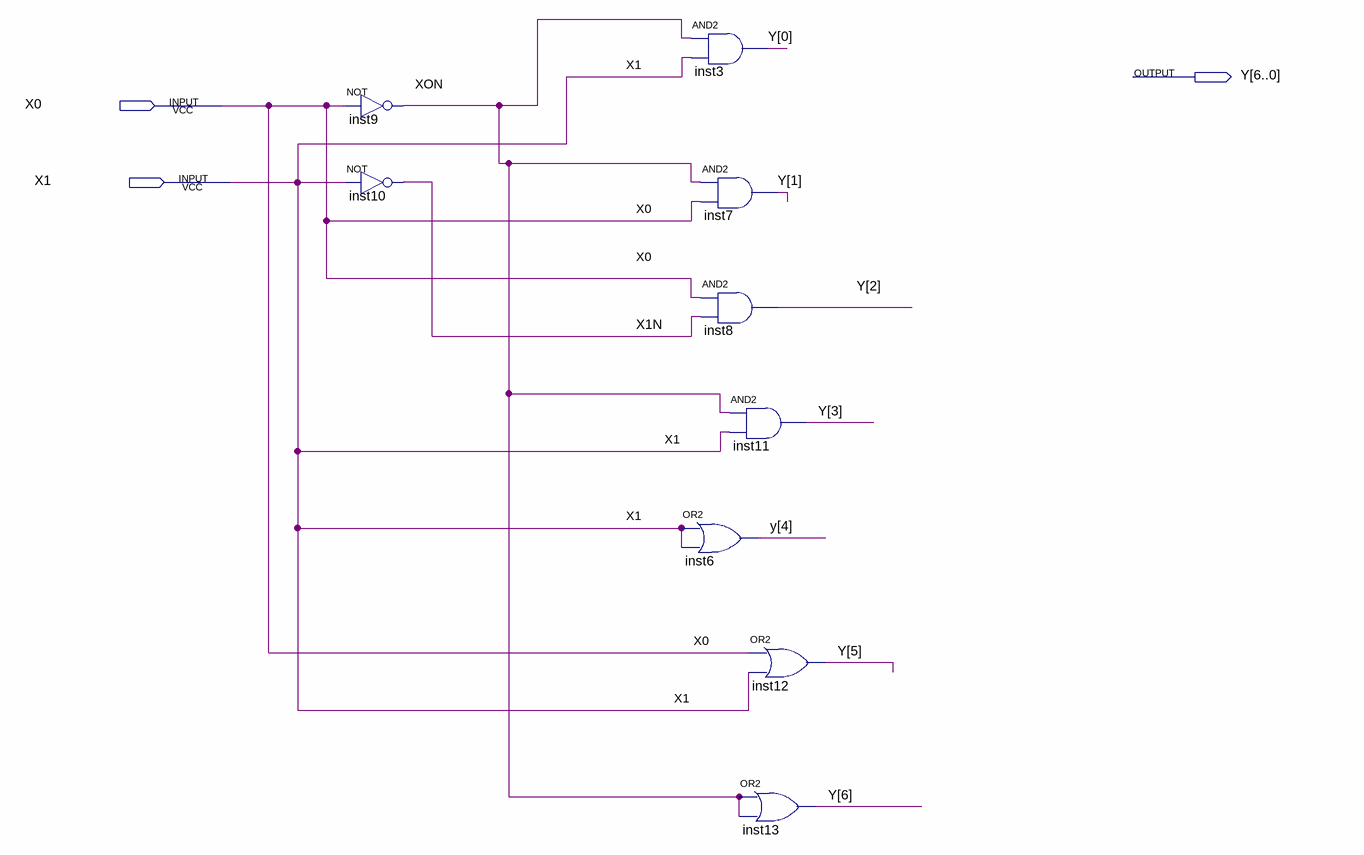
[diagram p0: schematic sheet]
// Quartus schematic TETRA_to_7_seg.bdf as structural Verilog: 9 symbols, 3 pins
module TETRA_to_7_seg (
  input  X0,
  input  X1,
  output [6:0] Y
);

  wire X1N, XON;

  not inst9 (XON, X0);
  not inst10 (X1N, X1);
  and inst3 (Y[0], XON, X1);
  and inst7 (Y[1], XON, X0);
  and inst8 (Y[2], X0, X1N);
  or inst6 (Y[4], X1, X1);
  and inst11 (Y[3], XON, X1);
  or inst12 (Y[5], X0, X1);
  or inst13 (Y[6], XON, XON);
endmodule
